# Altium schematic sheet Rbot-sensor-driver.schdoc
size A2
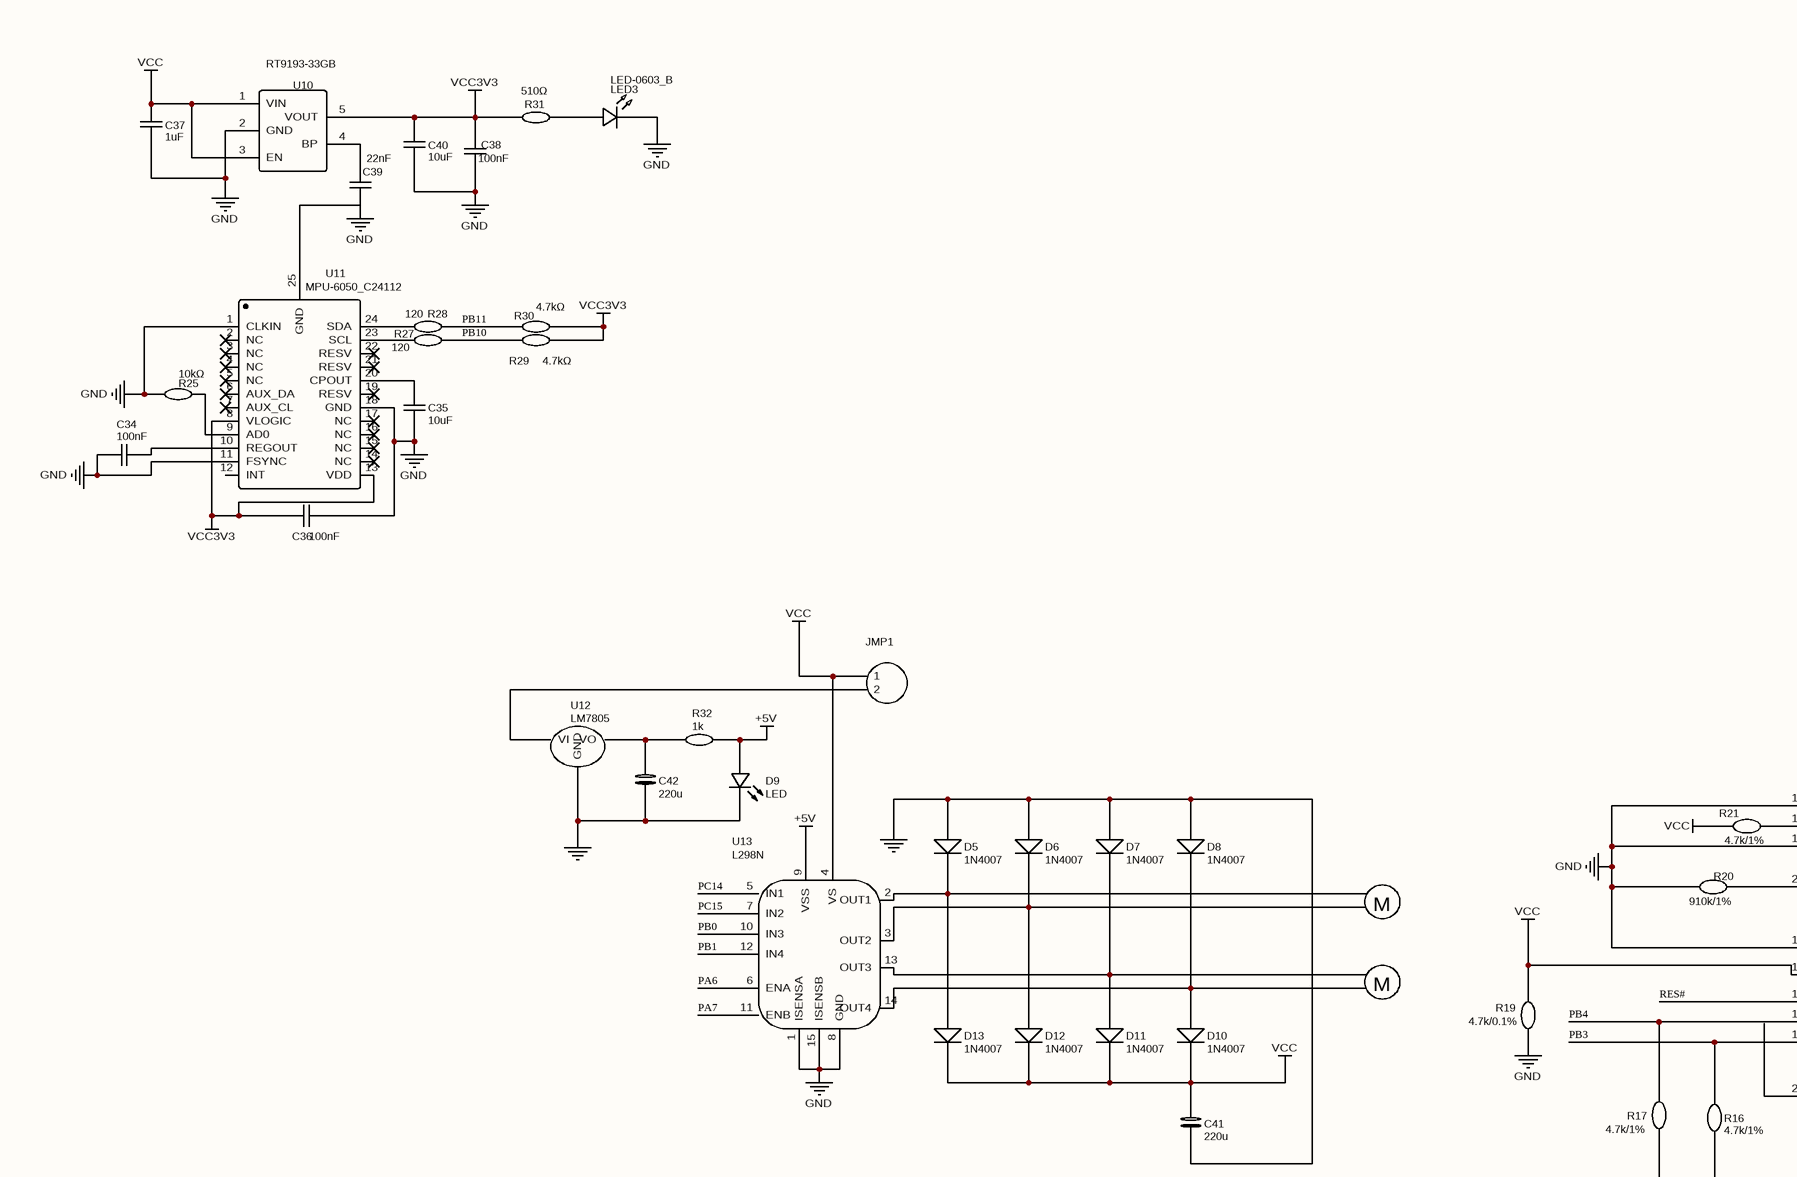
[diagram p0: Rbot-sensor-driver.schdoc, top left]
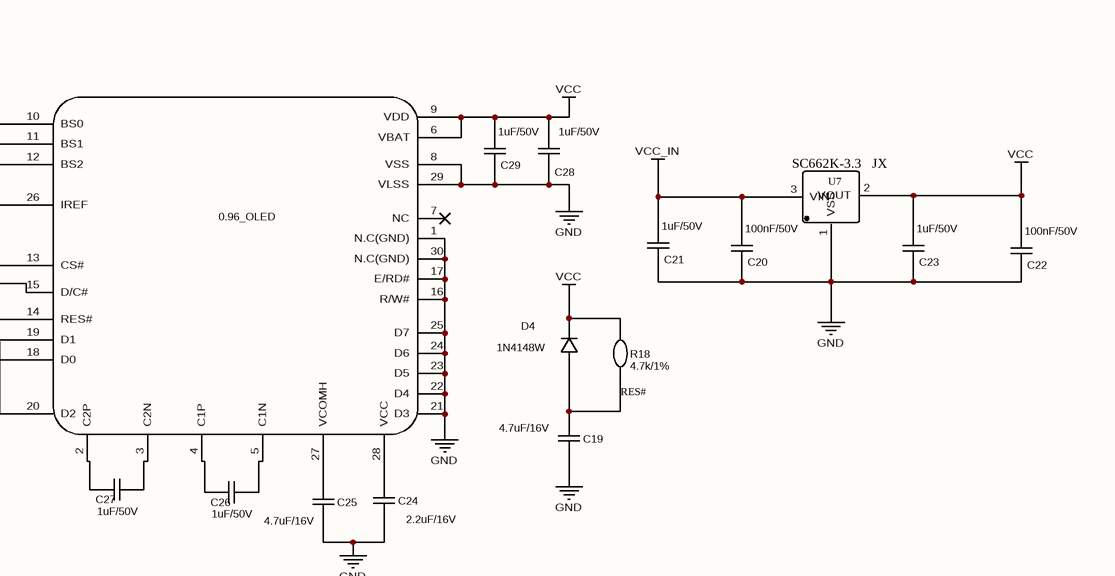
[diagram p1: Rbot-sensor-driver.schdoc, top right]
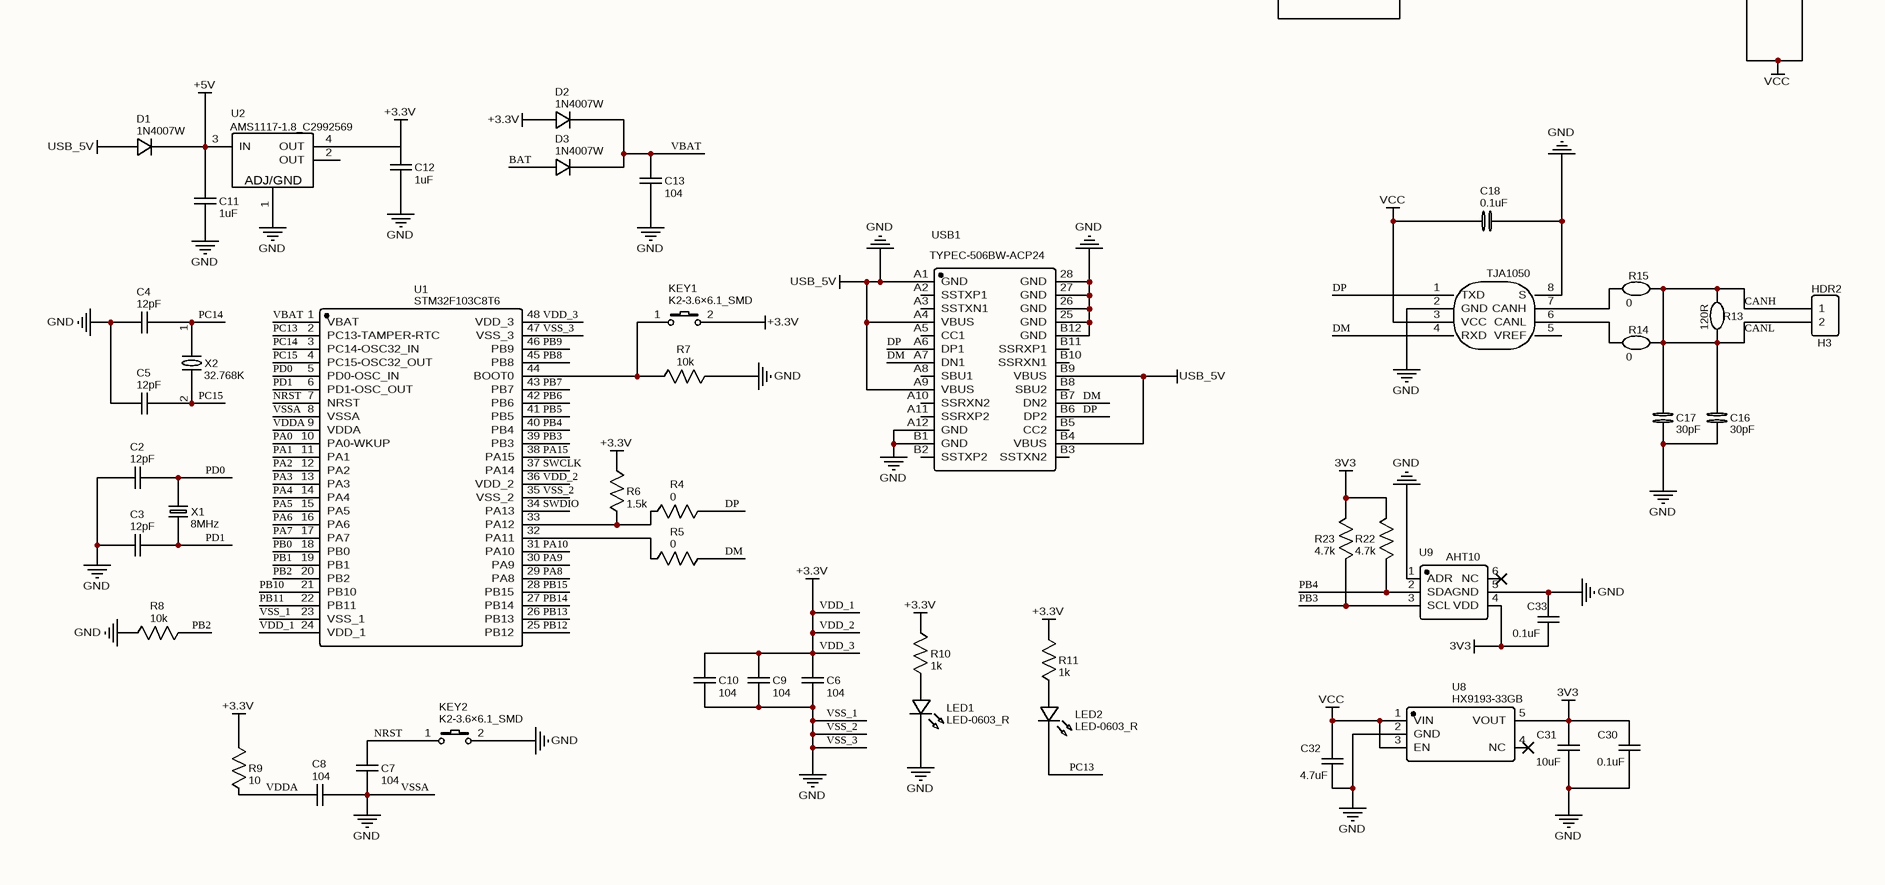
[diagram p2: Rbot-sensor-driver.schdoc, bottom left]

## Parts
0.96_OLED  0.96-OLED  [SSD1306-30PIN-JX]  (value not drawn)
C2  12pF  [C0603]
C3  12pF  [C0603]
C4  12pF  [C0603]
C5  12pF  [C0603]
C6  104  [C0603]
C7  104  [C0603]
C8  104  [C0603]
C9  104  [C0603]
C10  104  [C0603]
C11  1uF  [C0603]
C12  1uF  [C0603]
C13  104  [C0603]
C16  30pF  [C0603]
C17  30pF  [C0603]
C18  0.1uF  [C0603]
C19  4.7uF/16V  [0603_C_JX]
C20  100nF/50V  [0603_C_JX]
C21  1uF/50V  [0603_C_JX]
C22  100nF/50V  [0603_C_JX]
C23  1uF/50V  [0603_C_JX]
C24  2.2uF/16V  [0603_C_JX]
C25  4.7uF/16V  [0603_C_JX]
C26  1uF/50V  [0603_C_JX]
C27  1uF/50V  [0603_C_JX]
C28  1uF/50V  [0603_C_JX]
C29  1uF/50V  [0603_C_JX]
C30  0.1uF  [C0402]
C31  10uF  [C0402]
C32  4.7uF  [C0402]
C33  0.1uF  [C0402]
C34  100nF  [C0805]
C35  10uF  [C0805]
C36  100nF  [C0805]
C37  1uF  [C0805]
C38  100nF  [C0805]
C39  22nF  [C0805]
C40  10uF  [C0805]
C41  220u  [CP_8X13MM]
C42  220u  [CP_8X13MM]
D1  1N4007W  [SOD-123_L2.8-W1.8-LS3.7-RD]
D2  1N4007W  [SOD-123_L2.8-W1.8-LS3.7-RD]
D3  1N4007W  [SOD-123_L2.8-W1.8-LS3.7-RD]
D4  1N4148W  [SOD-523_JX]
D5  1N4007  [DO-41]
D6  1N4007  [DO-41]
D7  1N4007  [DO-41]
D8  1N4007  [DO-41]
D9  LED  [LED3MM]
D10  1N4007  [DO-41]
D11  1N4007  [DO-41]
D12  1N4007  [DO-41]
D13  1N4007  [DO-41]
H3  HDR2  [HDR-F-2.54_1X2]
JMP1  SIP2  [HDR1X2]  (value not drawn)
KEY1  K2-3.6×6.1_SMD  [KEY-SMD_2P-L6.2-W3.6-LS8.0]
KEY2  K2-3.6×6.1_SMD  [KEY-SMD_2P-L6.2-W3.6-LS8.0]
LED1  LED-0603_R  [LED0603_RED]
LED2  LED-0603_R  [LED0603_RED]
LED3  LED-0603_B  [LED0603_BLUE]
R4  0  [R0603]
R5  0  [R0603]
R6  1.5k  [R0603]
R7  10k  [R0603]
R8  10k  [R0603]
R9  10  [R0603]
R10  1k  [R0603]
R11  1k  [R0603]
R13  120R  [R0603]
R14  0  [R0603]
R15  0  [R0603]
R16  4.7k/1%  [0603_R_JX]
R17  4.7k/1%  [0603_R_JX]
R18  4.7k/1%  [0603_R_JX]
R19  4.7k/0.1%  [0603_R_JX]
R20  910k/1%  [0603_R_JX]
R21  4.7k/1%  [0603_R_JX]
R22  4.7k  [R0402]
R23  4.7k  [R0402]
R25  10kΩ  [R0805]
R27  120  [R0805]
R28  120  [R0805]
R29  4.7kΩ  [R0805]
R30  4.7kΩ  [R0805]
R31  510Ω  [R0805]
R32  1k  [R3]
U1  STM32F103C8T6  [LQFP-48_L7.0-W7.0-P0.50-LS9.0-BL]
U2  AMS1117-1.8_C2992569  [SOT-223-3_L6.4-W3.5-P2.30-LS7.0-BR]
U6  TJA1050  [SOIC-8_L5.0-W4.0-P1.27-LS6.0-BL]
U7  SC662K-3.3   JX  [SOT23_JX]
U8  HX9193-33GB  [SOT-23-5_L3.0-W1.7-P0.95-LS2.8-BR]
U9  AHT10  [AHT10-SMD-6]
U10  RT9193-33GB  [SOT-23-5_L3.0-W1.7-P0.95-LS2.8-BR]
U11  MPU-6050_C24112  [QFN-24_L4.0-W4.0-P0.50-BL-EP2.7]
U12  LM7805  [NONE]
U13  L298N  [NONE]
USB1  TYPEC-506BW-ACP24  [USB-C-SMD_TYPEC-506BW-ACP24]
X1  8MHz  [HC-49S_L11.4-W4.8]
X2  32.768K  [OSC-SMD_2P-L3.2-W1.5-1]

## Nets
3V3: C30.2 C31.2 C33.1 R22.2 R23.2 U8.5(VOUT) U9.4(VDD)
+5V: C11.1 D1.1 D9.A R32.2 U2.3(IN) U13.9(VSS)
VCC: 0.96_OLED.6(VBAT) 0.96_OLED.9(VDD) 0.96_OLED.15(D/C#) C18.1 C22.2 C23.2 C28.2 C29.2 C32.2 C37.2 C41.1 D4.2(K) D10.2(K) D11.2(K) D12.2(K) D13.2(K) JMP1.1 R16.1 R17.1 R18.2 R19.2 R21.1 U6.3(VCC) U7.2(VOUT) U8.1(VIN) U8.3(EN) U10.1(VIN) U10.3(EN) U13.4(VS)
VCC3V3: C36.2 C38.2 C40.2 R29.1 R30.1 R31.1 U10.5(VOUT) U11.8(VLOGIC) U11.13(VDD)
VCC_IN: C20.2 C21.2 U7.3(VIN)
VDD_1: C6.2 C9.2 C10.2 C12.1 D2.2 KEY1.2 R6.2 R9.1 R10.1 R11.1 U1.24(VDD_1) U1.36(VDD_2) U1.48(VDD_3)  [also labelled +3.3V, VDD_2, VDD_3]
VSS_1: 0.96_OLED.1(N.C(GND)) 0.96_OLED.8(VSS) 0.96_OLED.10(BS0) 0.96_OLED.12(BS2) 0.96_OLED.13(CS#) 0.96_OLED.16(R/W#) 0.96_OLED.17(E/RD#) 0.96_OLED.21(D3) 0.96_OLED.22(D4) 0.96_OLED.23(D5) 0.96_OLED.24(D6) 0.96_OLED.25(D7) 0.96_OLED.29(VLSS) 0.96_OLED.30(N.C(GND)) C2.1 C3.1 C4.1 C5.1 C6.1 C7.1 C8.1 C9.1 C10.1 C11.2 C12.2 C13.2 C16.1 C17.1 C18.2 C19.2 C20.1 C21.1 C22.1 C23.1 C24.2 C25.2 C28.1 C29.1 C30.1 C31.1 C32.1 C33.2 C34.2 C35.1 C36.1 C37.1 C38.1 C40.1 C41.2 C42.2 D1.2 D5.1(A) D6.1(A) D7.1(A) D8.1(A) D9.K KEY2.2 LED1.2 LED3.2 R7.2 R8.1 R19.1 R20.1 R25.1 U1.8(VSSA) U1.23(VSS_1) U1.35(VSS_2) U1.47(VSS_3) U2.1(ADJ/GND) U6.2(GND) U6.8(S) U7.1(VSS) U8.2(GND) U9.1(ADR) U9.5(GND) U10.2(GND) U11.1(CLKIN) U11.11(FSYNC) U11.18(GND) U11.25(GND) U12.GND U13.1(ISENSA) U13.8(GND) U13.15(ISENSB) USB1.25(GND) USB1.26(GND) USB1.27(GND) USB1.28(GND) USB1.A1(GND) USB1.A4(VBUS) USB1.A9(VBUS) USB1.A12(GND) USB1.B1(GND) USB1.B4(VBUS) USB1.B9(VBUS) USB1.B12(GND)  [also labelled GND, USB_5V, VSS_2, VSS_3, VSSA]
BAT: D3.2
CANH: C16.2 C17.2 H3.1 H3.2 R13.1 R13.2 R14.2 R15.2  [also labelled CANL]
DM: R5.2 U6.4(RXD) USB1.A7(DN1) USB1.B7(DN2)
DP: R4.2 U6.1(TXD) USB1.A6(DP1) USB1.B6(DP2)
NRST: C7.2 KEY2.1 U1.7(NRST)
PA0: U1.10(PA0-WKUP)
PA1: U1.11(PA1)
PA2: U1.12(PA2)
PA3: U1.13(PA3)
PA4: U1.14(PA4)
PA5: U1.15(PA5)
PA6: U1.16(PA6) U13.6(ENA)
PA7: U1.17(PA7) U13.11(ENB)
PA8: U1.29(PA8)
PA9: U1.30(PA9)
PA10: U1.31(PA10)
PA15: U1.38(PA15)
PB0: U1.18(PB0) U13.10(IN3)
PB1: U1.19(PB1) U13.12(IN4)
PB2: R8.2 U1.20(PB2)
PB3: 0.96_OLED.18(D0) R16.2 R23.1 U1.39(PB3) U9.3(SCL)
PB4: 0.96_OLED.19(D1) R17.2 R22.1 U1.40(PB4) U9.2(SDA)
PB5: U1.41(PB5)
PB6: U1.42(PB6)
PB7: U1.43(PB7)
PB8: U1.45(PB8)
PB9: U1.46(PB9)
PB10: R27.1 R29.2 U1.21(PB10)
PB11: R28.1 R30.2 U1.22(PB11)
PB12: U1.25(PB12)
PB13: U1.26(PB13)
PB14: U1.27(PB14)
PB15: U1.28(PB15)
PC13: LED2.2 U1.2(PC13-TAMPER-RTC)
PC14: C4.2 U1.3(PC14-OSC32_IN) U13.5(IN1) X2.1
PC15: C5.2 U1.4(PC15-OSC32_OUT) U13.7(IN2) X2.2
PD0: C2.2 U1.5(PD0-OSC_IN) X1.2
PD1: C3.2 U1.6(PD1-OSC_OUT) X1.1
RES#: 0.96_OLED.14(RES#) C19.1 D4.1(A) R18.1
SWCLK: U1.37(PA14)
SWDIO: U1.34(PA13)
VBAT: C13.1 D2.1 D3.1 U1.1(VBAT)
VDDA: C8.2 R9.2 U1.9(VDDA)
Net0.96_OLED_2: 0.96_OLED.2(C2P) C27.2
Net0.96_OLED_3: 0.96_OLED.3(C2N) C27.1
Net0.96_OLED_4: 0.96_OLED.4(C1P) C26.2
Net0.96_OLED_5: 0.96_OLED.5(C1N) C26.1
Net0.96_OLED_11: 0.96_OLED.11(BS1) R21.2
Net0.96_OLED_26: 0.96_OLED.26(IREF) R20.2
Net0.96_OLED_27: 0.96_OLED.27(VCOMH) C25.1
Net0.96_OLED_28: 0.96_OLED.28(VCC) C24.1
NetC34_1: C34.1 U11.10(REGOUT)
NetC35_2: C35.2 U11.20(CPOUT)
NetC39_1: C39.1 U10.4(BP)
NetC42_1: C42.1 R32.1 U12.VO
NetD5_2: D5.2(K) D13.1(A) U13.2(OUT1)
NetD6_2: D6.2(K) D12.1(A) U13.3(OUT2)
NetD7_2: D7.2(K) D11.1(A) U13.13(OUT3)
NetD8_2: D8.2(K) D10.1(A) U13.14(OUT4)
NetJMP1_2: JMP1.2 U12.VI
NetKEY1_1: KEY1.1 R7.1 U1.44(BOOT0)
NetLED1_1: LED1.1 R10.2
NetLED2_1: LED2.1 R11.2
NetLED3_1: LED3.1 R31.2
NetR4_1: R4.1 R6.1 U1.33(PA12)
NetR5_1: R5.1 U1.32(PA11)
NetR14_1: R14.1 U6.6(CANL)
NetR15_1: R15.1 U6.7(CANH)
NetR25_2: R25.2 U11.9(AD0)
NetR27_2: R27.2 U11.23(SCL)
NetR28_2: R28.2 U11.24(SDA)

Not connected (* = marked no-connect by the designer): 0.96_OLED 7(NC)* 20(D2); C39 2; U2 2(OUT) 4(OUT); U6 5(VREF); U8 4(NC)*; U9 6(NC)*; U11 2(NC)* 3(NC)* 4(NC)* 5(NC)* 6(AUX_DA)* 7(AUX_CL)* 12(INT) 14(NC)* 15(NC)* 16(NC)* 17(NC)* 19(RESV)* 21(RESV)* 22(RESV)*; USB1 A2(SSTXP1) A3(SSTXN1) A5(CC1) A8(SBU1) A10(SSRXN2) A11(SSRXP2) B2(SSTXP2) B3(SSTXN2) B5(CC2) B8(SBU2) B10(SSRXN1) B11(SSRXP1)

## Notes on the sheet
- M

## Library data of the parts
0.96_OLED = 0.96-OLED: Contributor: 591208A; spicePre: U; spiceSymbolName: 0.96-OLED-30Pin
C2-C5 = 12pF: nameAlias: Value(F); Contributor: LCEDA_Lib; spicePre: C; spiceSymbolName: C_0603_US
C6-C10 C13 = 104: nameAlias: Value(F); Contributor: LCEDA_Lib; spicePre: C; spiceSymbolName: C_0603_US
C11 C12 = 1uF: nameAlias: Value(F); Contributor: LCEDA_Lib; spicePre: C; spiceSymbolName: C_0603_US
C16 C17 = 30pF: nameAlias: Value(F); Contributor: LCEDA_Lib; spicePre: C; spiceSymbolName: C_0603_EU
C18 C30 C33 = 0.1uF: nameAlias: Value(F); Contributor: LCEDA_Lib; spicePre: C
  C18: spiceSymbolName: C_0603_EU
  C30 C33: spiceSymbolName: C_0603_US
C19 C25 = 4.7uF/16V: nameAlias: Value(F); spicePre: C; spiceSymbolName: Cap_0402_US
C20 C22 = 100nF/50V: nameAlias: Value(F); spicePre: C; spiceSymbolName: Cap_0402_US
C21 C23 C26-C29 = 1uF/50V: nameAlias: Value(F); spicePre: C; spiceSymbolName: Cap_0402_US
C24 = 2.2uF/16V: nameAlias: Value(F); spicePre: C; spiceSymbolName: Cap_0402_US
C31 = 10uF: nameAlias: Value(F); Contributor: LCEDA_Lib; spicePre: C; spiceSymbolName: C_0603_US
C32 = 4.7uF: nameAlias: Value(F); Contributor: LCEDA_Lib; spicePre: C; spiceSymbolName: C_0603_US
C34 C36 C38 = 100nF: Manufacturer: HEC(Holy Stone Enterprise); Manufacturer Part: C0805X104K101T; nameAlias: Capacitance; Contributor: LCSC; Supplier: LCSC; Supplier Part: C485772; JLCPCB Part Class: Extended Part; spicePre: C; spiceSymbolName: C0805X104K101T_C485772
C35 C40 = 10uF: Manufacturer: muRata(村田); Manufacturer Part: GRT21BC71E106KE13L; nameAlias: Capacitance; Contributor: lcsc; Supplier: LCSC; Supplier Part: C882505; spicePre: C; spiceSymbolName: GRT21BC71E106KE13L
C37 = 1uF: Manufacturer Part: CL21F105ZBFNNNE; Manufacturer: SAMSUNG; nameAlias: Capacitance; Supplier: LCSC; Supplier Part: C5422; JLCPCB Part Class: Extended Part; spicePre: C; spiceSymbolName: CL21F105ZBFNNNE
C39 = 22nF: Manufacturer: Huaxin S&T; Manufacturer Part: 0805B223K251CT; nameAlias: Capacitance; Contributor: LCSC; Supplier: LCSC; Supplier Part: C303902; JLCPCB Part Class: Extended Part; spicePre: C; spiceSymbolName: 0805B223K251CT
C41 C42 = 220u: nameAlias: Value(F); Manufacturer Part: ?; spicePre: C; spiceSymbolName: Capacitor
D1-D3 = 1N4007W: Manufacturer: BLUE ROCKET; Contributor: LCEDA_Lib; Supplier: LCSC; Supplier Part: C328592; Manufacturer Part: 1N4007W; spicePre: D; spiceSymbolName: 1N4007W
D4 = 1N4148W: Manufacturer: SEMTECH; SMT Type: Basic; Supplier: LCSC; Manufacturer Part: 1N4148W; image: //image.lceda.cn/szlcsc/C81598.jpg; Supplier Part: C81598; LCSC Assembly: Yes; spicePre: D; spiceSymbolName: 1N4148W_C81598
D5-D8 D10-D13 = 1N4007: catid: 20; sourceId: 397tPa8uQ; Manufacturer Part: ?; spicePre: D
D9 = LED: nameAlias: Model; Manufacturer Part: ?; spicePre: D; spiceSymbolName: LED
H3 = HDR2: Contributor: LCEDA_Lib; Supplier Part: C49661; Supplier: LCSC; spicePre: H; spiceSymbolName: HDR-F-2.54_1x2
JMP1 = SIP2: catid: 20; Manufacturer Part: ?; spicePre: P
KEY1 KEY2 = K2-3.6×6.1_SMD: Manufacturer Part: K2-1107ST-A4SW-06; Contributor: LCEDA_Lib; 制造商: 韩国韩荣; Supplier Part: C118141; Supplier: LCSC; spicePre: K; spiceSymbolName: K2-3.6×6.1_SMD
LED1 LED2 = LED-0603_R: Manufacturer: EVERLIGHT(台湾亿光); Manufacturer Part: 19-217/R6C-AL1M2VY/3T; Contributor: LCEDA_01; Supplier Part: C72044; Supplier: LCSC; spicePre: L; spiceSymbolName: LED-0603_R
LED3 = LED-0603_B: Manufacturer: EVERLIGHT(台湾亿光); Manufacturer Part: 19-217/BHC-ZL1M2RY/3T; Contributor: LCEDA_01; Supplier Part: C72041; Supplier: LCSC; spicePre: L; spiceSymbolName: LED-0603_B
R4 R5 R14 R15 = 0: nameAlias: Value(Ω); Contributor: LCEDA_Lib; spicePre: R
  R4 R5: spiceSymbolName: R_0603_US
  R14 R15: spiceSymbolName: R_0603_EU
R6 = 1.5k: nameAlias: Value(Ω); Contributor: LCEDA_Lib; spicePre: R; spiceSymbolName: R_0603_US
R7 R8 = 10k: nameAlias: Value(Ω); Contributor: LCEDA_Lib; spicePre: R; spiceSymbolName: R_0603_US
R9 = 10: nameAlias: Value(Ω); Contributor: LCEDA_Lib; spicePre: R; spiceSymbolName: R_0603_US
R10 R11 = 1k: nameAlias: Value(Ω); Contributor: LCEDA_Lib; spicePre: R; spiceSymbolName: R_0603_US
R13 = 120R: nameAlias: Value(Ω); Contributor: LCEDA_Lib; spicePre: R; spiceSymbolName: R_0603_EU
R16-R18 R21 = 4.7k/1%: nameAlias: Value(Ω); spicePre: R; spiceSymbolName: Res_AXIAL-0.3(1/8W)_EU
R19 = 4.7k/0.1%: nameAlias: Value(Ω); spicePre: R; spiceSymbolName: Res_AXIAL-0.3(1/8W)_EU
R20 = 910k/1%: nameAlias: Value(Ω); spicePre: R; spiceSymbolName: Res_AXIAL-0.3(1/8W)_EU
R22 R23 = 4.7k: nameAlias: Value(Ω); Contributor: LCEDA_Lib; spicePre: R; spiceSymbolName: R_0402_US
R25 = 10kΩ: Manufacturer: Viking Tech; Manufacturer Part: AR05BTDW1002; Resistance (Ohms): 10K; nameAlias: Resistance; Contributor: LCSC; Supplier: LCSC; Supplier Part: C319942; JLCPCB Part Class: Extended Part; spicePre: R; spiceSymbolName: AR05BTDW1002
R27 R28 = 120: Manufacturer: YAGEO; Manufacturer Part: RC0805JR-07120RL; nameAlias: Resistance (Ohms); Resistance: 120Ω; Supplier: LCSC; Supplier Part: C114244; JLCPCB Part Class: Extended Part; spicePre: R; spiceSymbolName: RC0805JR-07120RL
R29 R30 = 4.7kΩ: Manufacturer: Tyohm; Manufacturer Part: RMC08054.7K1%N; Resistance (Ohms): 4.7K; nameAlias: Resistance; Contributor: LCSC; Supplier: LCSC; Supplier Part: C269746; JLCPCB Part Class: Extended Part; spicePre: R; spiceSymbolName: RMC08054.7K1%N
R31 = 510Ω: Manufacturer: UniOhm; Manufacturer Part: 0805W8J0511T5E; nameAlias: Resistance; Resistance (Ohms): 510; Supplier: LCSC; Supplier Part: C25317; JLCPCB Part Class: Extended Part; spicePre: R; spiceSymbolName: 0805W8J0511T5E
R32 = 1k: nameAlias: Value(Ω); Manufacturer Part: ?; spicePre: R; spiceSymbolName: Resistor
U1 = STM32F103C8T6: Manufacturer: ST(意法半导体); timeStamp: 1455028086; Supplier: LCSC; Manufacturer Part: STM32F103C8T6; Supplier Part: C8734; JLCPCB Part Class: Extended Part; spicePre: U; spiceSymbolName: STM32F103C8T6
U2 = AMS1117-1.8_C2992569: Manufacturer: 国芯佳品; Contributor: lcsc; Supplier: LCSC; Supplier Part: C2992569; Manufacturer Part: AMS1117-1.8; JLCPCB Part Class: Extended Part; spicePre: U; spiceSymbolName: AMS1117-1.8_C2992569
U6 = TJA1050: Manufacturer: NXP; Manufacturer Part: TJA1050T/CM,118; Package Display: No; Supplier: LCSC; Supplier Part: C6952; JLCPCB Part Class: Basic Part; spicePre: U; spiceSymbolName: TJA1050T/CM,118
U8 = HX9193-33GB: Manufacturer: hengjiaxing; Contributor: LCSC; SMT Type: Extend; Supplier: LCSC; Supplier Part: C296123; Manufacturer Part: HX9193-33GB; LCSC Assembly: Yes; spicePre: U; spiceSymbolName: HX9193-33GB
U9 = AHT10: Manufacturer: 广州奥松; Contributor: HiveCloud; Manufacturer Part: AHT10; Supplier: LCSC; Supplier Part: C368909; link: https://atta.szlcsc.com/upload/public/pdf/source/20190129/C368909_B294364A5189322D50DF5028F78C32FD.pdf; spicePre: U; spiceSymbolName: AHT10
U10 = RT9193-33GB: Manufacturer: RICHTEK; Supplier: LCSC; Manufacturer Part: RT9193-33GB; Supplier Part: C15651; JLCPCB Part Class: Extended Part; spicePre: U; spiceSymbolName: RT9193-33GB
U11 = MPU-6050_C24112: Manufacturer: InvenSense; sourceId: 1T5FDZYC8; timeStamp: 1462265206; Supplier: LCSC; Manufacturer Part: MPU-6050; Supplier Part: C24112; JLCPCB Part Class: Basic Part; spicePre: U; spiceSymbolName: MPU-6050_C24112
U12 = LM7805: catid: 20; Contributor: KiCad; sourceId: NzmkUSsqZ; Manufacturer Part: ?; spicePre: U
U13 = L298N: catid: 20; sourceId: HXUgCYWig; Manufacturer Part: ?; spicePre: U
USB1 = TYPEC-506BW-ACP24: Manufacturer: XUNPU(讯普); Contributor: LCSC; Supplier: LCSC; Supplier Part: C2895019; Manufacturer Part: TYPEC-506BW-ACP24; JLCPCB Part Class: Extended Part; spicePre: U; spiceSymbolName: TYPEC-506BW-ACP24
X1 = 8MHz: Manufacturer: TAITIEN(泰艺电子); Manufacturer Part: XJHCELNANF-8M; nameAlias: Value; Contributor: LCSC; Supplier: LCSC; Supplier Part: C123298; JLCPCB Part Class: Extended Part; spicePre: X; spiceSymbolName: XJHCCLNAND-8M
X2 = 32.768K: Manufacturer Part: 贴片晶振32.768k; Manufacturer: null; Contributor: LCSC; Supplier: LCSC; Supplier Part: C9900003950; JLCPCB Part Class: Extended Part; spicePre: X; spiceSymbolName: 贴片晶振32.768K